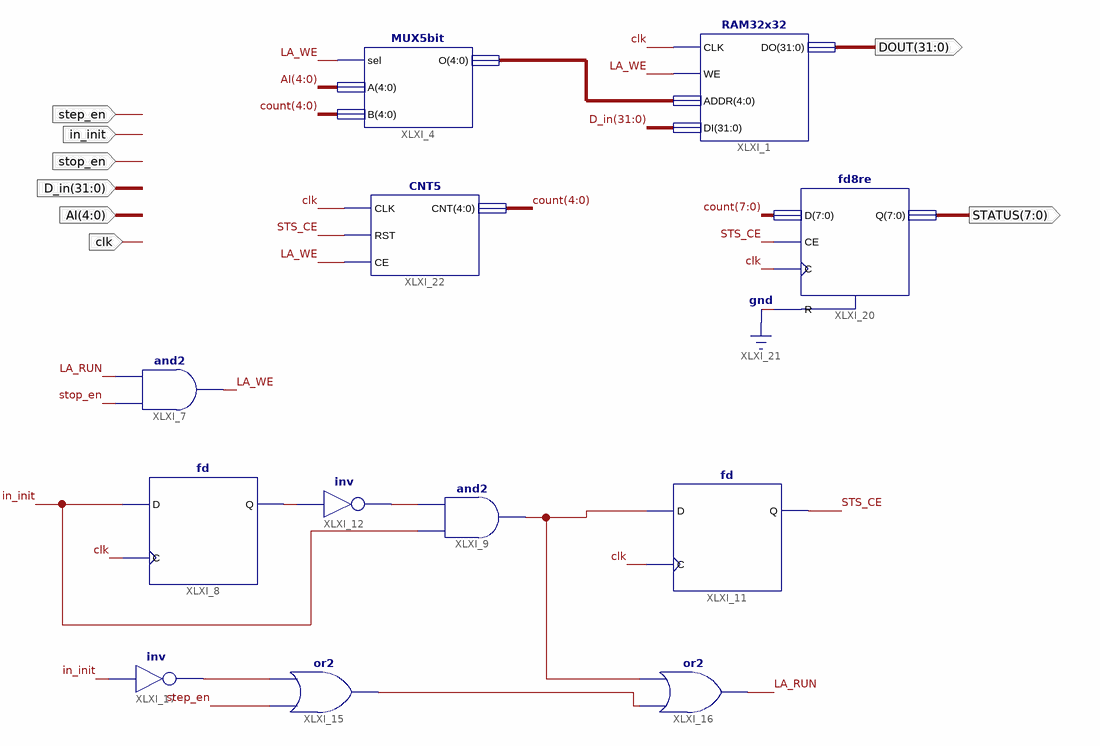
[diagram p0: schematic sheet 1]
// Xilinx ISE schematic logic_analyzer.sch (spartan6) as structural Verilog: 12 symbols, 8 ports
module logic_analyzer (
  input  step_en,
  input  in_init,
  input  stop_en,
  input  [31:0] D_in,
  input  [4:0] AI,
  input  clk,
  output [31:0] DOUT,
  output [7:0] STATUS
);

  wire LA_RUN, LA_WE, STS_CE, XLXN_39, XLXN_42, XLXN_43, XLXN_55, XLXN_58;
  wire [4:0] XLXN_54;
  wire [7:0] count;

  MUX5bit XLXI_4 (.sel(LA_WE), .A(AI), .B(count[4:0]), .O(XLXN_54));
  and XLXI_7 (LA_WE, stop_en, LA_RUN);
  fd XLXI_8 (.C(clk), .D(in_init), .Q(XLXN_42));
  and XLXI_9 (XLXN_39, in_init, XLXN_43);
  fd XLXI_11 (.C(clk), .D(XLXN_39), .Q(STS_CE));
  not XLXI_12 (XLXN_43, XLXN_42);
  RAM32x32 XLXI_1 (.CLK(clk), .WE(LA_WE), .ADDR(XLXN_54), .DI(D_in), .DO(DOUT));
  or XLXI_15 (XLXN_58, step_en, XLXN_55);
  or XLXI_16 (LA_RUN, XLXN_58, XLXN_39);
  not XLXI_17 (XLXN_55, in_init);
  fd8re XLXI_20 (.C(clk), .CE(STS_CE), .D(count), .R(1'b0), .Q(STATUS));
  CNT5 XLXI_22 (.CLK(clk), .RST(STS_CE), .CE(LA_WE), .CNT(count[4:0]));
endmodule
